# EAGLE design EBN_WPWR_V01 (EAGLE 7.3.0)
CNAME: EasyBoard Nano; CREVISION: 2.0; DESIGNER: Martin Olejar
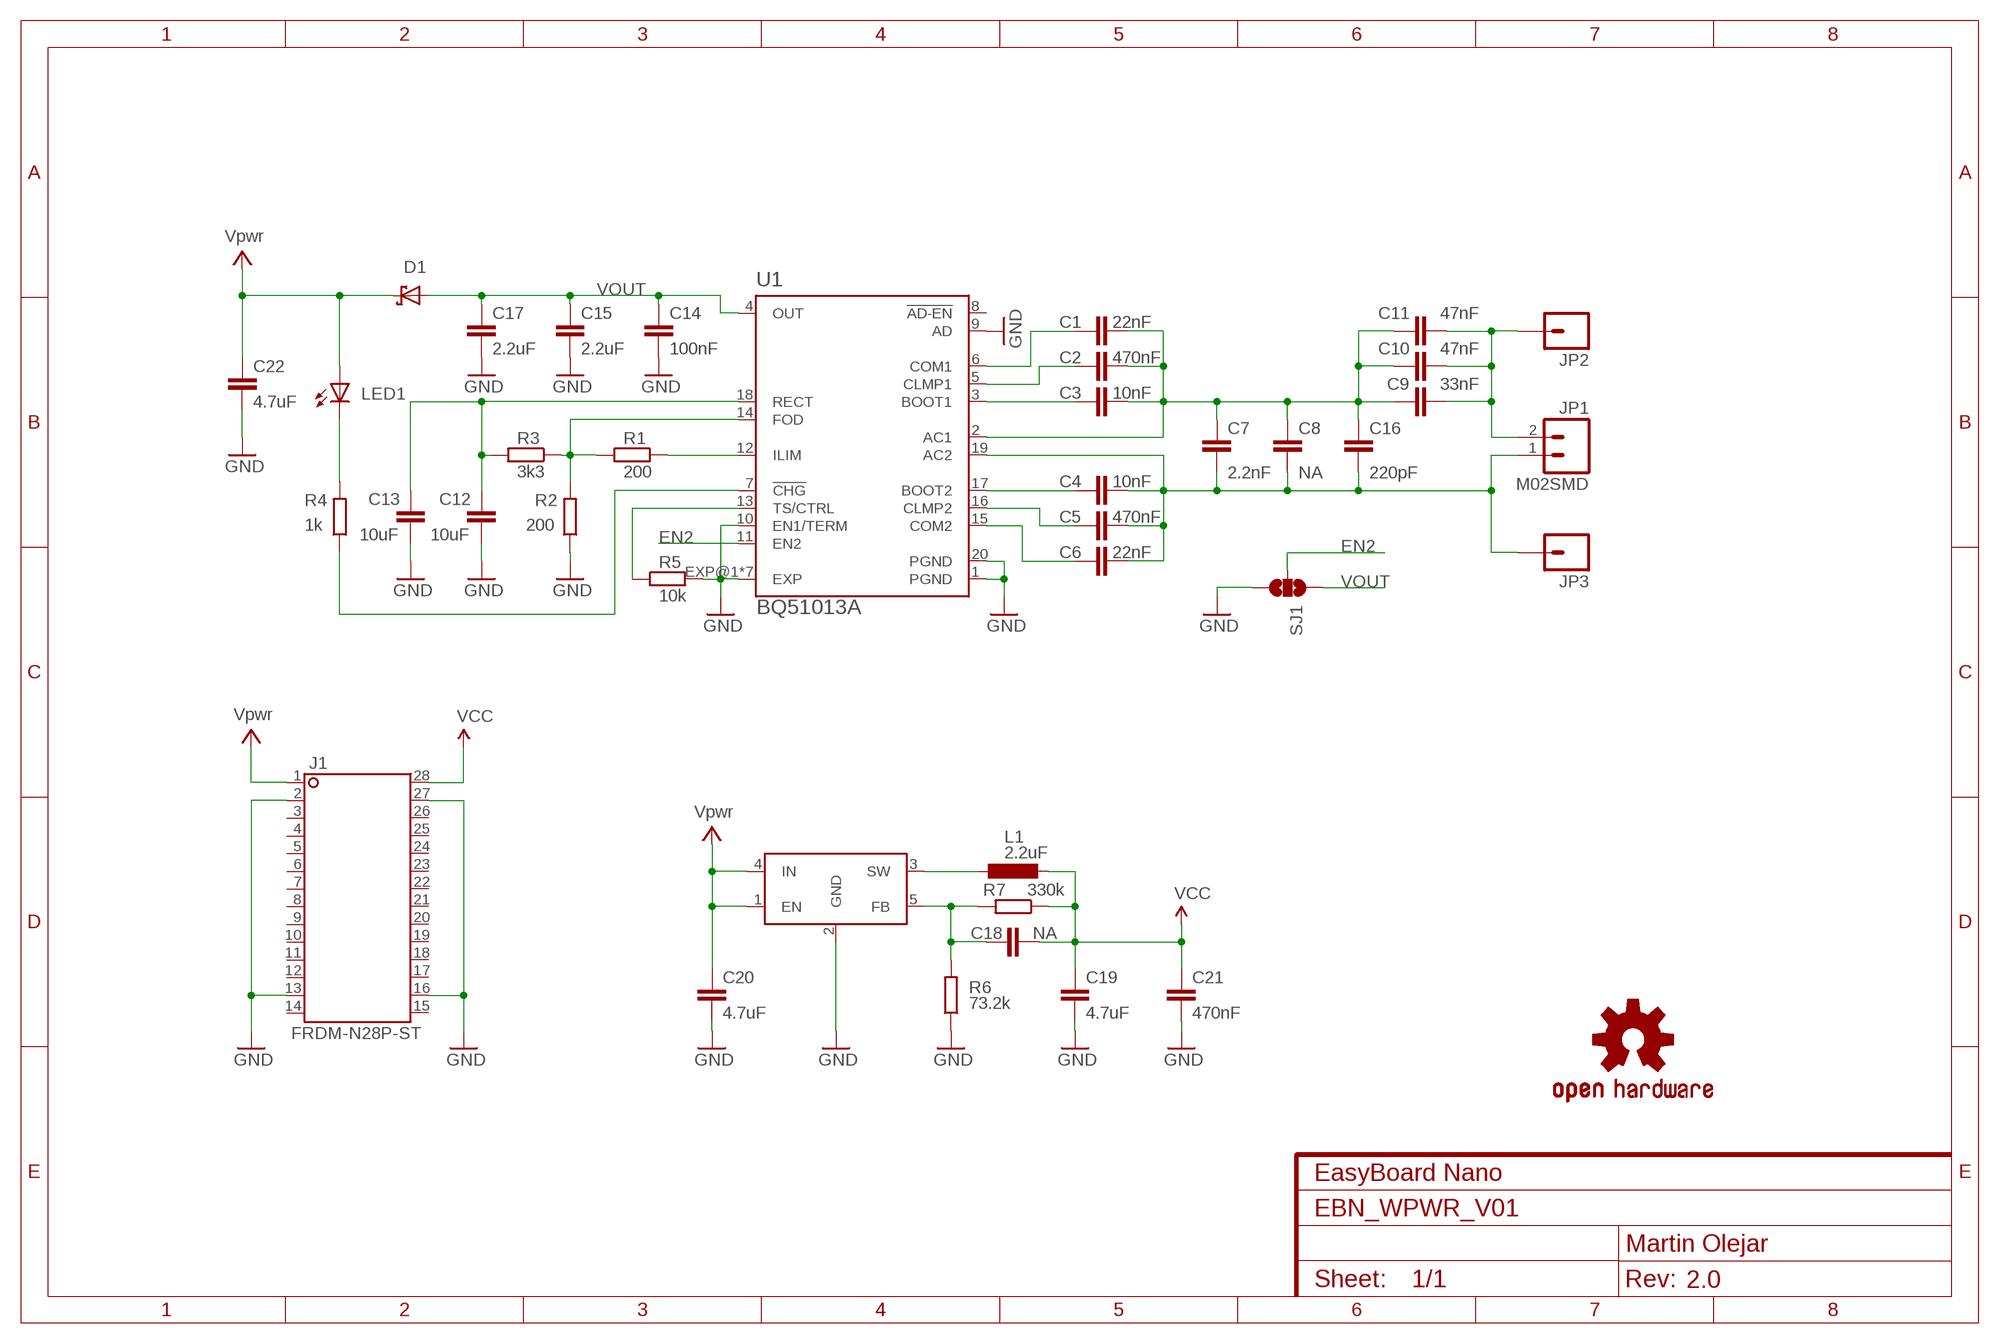
[diagram p0: schematic, sheet 1]

## Parts
C1  22nF  C-EUC0603  [C0603]
C2  470nF  C-EUC0603  [C0603]
C3  10nF  C-EUC0603  [C0603]
C4  10nF  C-EUC0603  [C0603]
C5  470nF  C-EUC0603  [C0603]
C6  22nF  C-EUC0603  [C0603]
C7  2.2nF  C-EUC0603  [C0603]
C8  NA  C-EUC0603  [C0603]
C9  33nF  C-EUC0603  [C0603]
C10  47nF  C-EUC0603  [C0603]
C11  47nF  C-EUC0603  [C0603]
C12  10uF  C-EUC0805  [C0805]
C13  10uF  C-EUC0805  [C0805]
C14  100nF  C-EUC0603  [C0603]
C15  2.2uF  C-EUC0603  [C0603]
C16  220pF  C-EUC0603  [C0603]
C17  2.2uF  C-EUC0603  [C0603]
C18  NA  C-EUC0603  [C0603]
C19  4.7uF  C-EUC0603  [C0603]
C20  4.7uF  C-EUC0603  [C0603]
C21  470nF  C-EUC0603  [C0603]
C22  4.7uF  C-EUC0603  [C0603]
D1  PMEG2010BER-SHOTTKY-SOD123FL  [SOD-123FL]
J1  FRDM-N28P-ST  [FRDM-N28P-SHIELD]
JP1  M02SMD  [1X02-1.25MM_SMD]
JP2  M01PTH_LONGPAD  [1X01_LONGPAD]
JP3  M01PTH_LONGPAD  [1X01_LONGPAD]
L1  2.2uF  L-EULPS3015  [LPS3015]
LED1  LEDCHIPLED_0603  [CHIPLED_0603]
LOGO1  OSHW-LOGOS  [OSHW-LOGO-S]
R1  200  R-EUR0603  [R0603]
R2  200  R-EUR0603  [R0603]
R3  3k3  R-EUR0603  [R0603]
R4  1k  R-EUR0603  [R0603]
R5  10k  R-EUR0603  [R0603]
R6  73.2k  R-EUR0603  [R0603]
R7  330k  R-EUR0603  [R0603]
SJ1  SJ2W-S  [JUMPER-SMD-S2X]
U1  BQ51013A  [RHL_R-VQFN-N20]
U$1  MP215P  [SOT23-5L]

## Nets
EN2: SJ1.2 U1.11(EN2)
GND: C12.1 C13.1 C14.1 C15.1 C17.1 C19.1 C20.1 C21.1 C22.1 J1.2 J1.13 J1.16 J1.27 R2.1 R5.2 R6.1 SJ1.3 U1.1(PGND) U1.9(AD) U1.10(EN1/TERM) U1.20(PGND) U1.EXP@1(EXP) U1.EXP@2(EXP) U1.EXP@3(EXP) U1.EXP@4(EXP) U1.EXP@5(EXP) U1.EXP@6(EXP) U1.EXP@7(EXP) U$1.2(GND)
N$1: C3.1 U1.3(BOOT1)
N$2: C2.1 U1.5(CLMP1)
N$3: C1.1 U1.6(COM1)
N$4: C1.2 C2.2 C3.2 C7.2 C8.2 C9.2 C10.2 C11.2 C16.2 U1.2(AC1)
N$5: C4.2 C5.2 C6.2 C7.1 C8.1 C16.1 JP1.1 JP3.1 U1.19(AC2)
N$6: C4.1 U1.17(BOOT2)
N$7: C5.1 U1.16(CLMP2)
N$8: C6.1 U1.15(COM2)
N$9: C9.1 C10.1 C11.1 JP1.2 JP2.1
N$11: LED1.C R4.2
N$12: R4.1 U1.7(!CHG)
N$14: R1.2 U1.12(ILIM)
N$15: R1.1 R2.2 R3.1 U1.14(FOD)
N$16: C12.2 C13.2 R3.2 U1.18(RECT)
N$24: L1.P$1 U$1.3(SW)
N$25: C18.2 R6.2 R7.2 U$1.5(FB)
PWR: C20.2 C22.2 D1.C J1.1 LED1.A U$1.1(EN) U$1.4(IN) ; supply symbol labelled Vpwr
TS: R5.1 U1.13(TS/CTRL)
VCC: C18.1 C19.2 C21.2 J1.28 L1.P$2 R7.1
VOUT: C14.2 C15.2 C17.2 D1.A SJ1.1 U1.4(OUT)
Unconnected: J1.3 J1.4 J1.5 J1.6 J1.7 J1.8 J1.9 J1.10 J1.11 J1.12 J1.14 J1.15 J1.17 J1.18 J1.19 J1.20 J1.21 J1.22 J1.23 J1.24 J1.25 J1.26 U1.8(!AD-EN)

## Library data of the parts
C1-C22 = atomx_RLC:C-EU: CAPACITOR, European symbol
D1 = atomx_DiscreteSemi:*-SHOTTKY-
J1 = atomx_Boards:FRDM-N28P: Dual In Line
JP1 = atomx_Connectors:M02: Standard 2-pin 0.1" header. Use with - straight break away headers ( PRT-00116) - right angle break away headers (PRT-00553) - swiss pins (PRT-00743) - machine pins (PRT-00117) - female headers (PRT-00115) Molex polarized connector foot print use with: PRT-08233 with associated crimp pins and housings. 2.54_SCREWTERM for use with PRT-10571. 3.5mm Screw Terminal footprints for PRT-08084 5mm Screw Terminal footprints for use with PRT-08432
JP2 JP3 = atomx_Connectors:M01: Header 1 Standard 1-pin 0.1" header. Use with straight break away headers (SKU : PRT-00116), right angle break away headers (PRT-00553), swiss pins (PRT-00743), machine pins (PRT-00117), and female headers (PRT-00115).
L1 = atomx_RLC:L-EU: INDUCTOR, European symbol
LED1 = atomx_Optic:LED: LED OSRAM: - CHIPLED LG R971, LG N971, LY N971, LG Q971, LY Q971, LO R971, LY R971 LH N974, LH R974 LS Q976, LO Q976, LY Q976 LO Q996 - Hyper CHIPLED LW Q18S LB Q993, LB Q99A, LB R99A - SideLED LS A670, LO A670, LY A670, LG A670, LP A670 LB A673, LV A673, LT A673, LW A673 LH A674 LY A675 LS A676, LA A676, LO A676, LY A676, LW A676 LS A679, LY A679, LG A679 - Hyper Micro SIDELED® LS Y876, LA Y876, LO Y876, LY Y876 LT Y87S - SmartLED LW L88C, LW L88S LB L89C, LB L89S, LG L890 LS L89K, LO L89K, LY L89K LS L896, LA L896, LO L896, LY L896 - TOPLED LS T670, LO T670, LY T670, LG T670, LP T670 LSG T670, LSP T670, LSY T670, LOP T670, LYG T670 LG T671, LOG T671, LSG T671 LB T673, LV T673, LT T673, LW T673 LH T674 LS T676, LA T676, LO T676, LY T676, LB T676, LH T676, LSB T676, LW T676 LB T67C, LV T67C, LT T67C, LS T67K, LO T67K, LY T67K, LW E67C LS E67B, LA E67B, LO E67B, LY E67B, LB E67C, LV E67C, LT E67C LW T67C LS T679, LY T679, LG T679 LS T770, LO T770, LY T770, LG T770, LP T770 LB T773, LV T773, LT T773, LW T773 LH T774 LS E675, LA E675, LY E675, LS T675 LS T776, LA T776, LO T776, LY T776, LB T776 LHGB T686 LT T68C, LB T68C - Hyper Mini TOPLED® LB M676 - Mini TOPLED Santana® LG M470 LS M47K, LO M47K, LY M47K Source: http://www.osram.convergy.de LUXEON: - LUMILED® LXK2-PW12-R00, LXK2-PW12-S00, LXK2-PW14-U00, LXK2-PW14-V00 LXK2-PM12-R00, LXK2-PM12-S00, LXK2-PM14-U00 LXK2-PE12-Q00, LXK2-PE12-R00, LXK2-PE12-S00, LXK2-PE14-T00, LXK2-PE14-U00 LXK2-PB12-K00, LXK2-PB12-L00, LXK2-PB12-M00, LXK2-PB14-N00, LXK2-PB14-P00, LXK2-PB14-Q00 LXK2-PR12-L00, LXK2-PR12-M00, LXK2-PR14-Q00, LXK2-PR14-R00 LXK2-PD12-Q00, LXK2-PD12-R00, LXK2-PD12-S00 LXK2-PH12-R00, LXK2-PH12-S00 LXK2-PL12-P00, LXK2-PL12-Q00, LXK2-PL12-R00 Source: www.luxeon.com KINGBRIGHT: KA-3528ASYC Source: www.kingbright.com
LOGO1 = atomx_Common:OSHW-LOGO: Open Source Hardware Logo This logo indicates the piece of hardware it is found on incorporates a OSHW license and/or adheres to the definition of open source hardware found here: http://freedomdefined.org/OSHW
R1-R7 = atomx_RLC:R-EU: RESISTOR, European symbol
SJ1 = atomx_Connectors:SJ2W: SMD solder JUMPER
U1 = atomx_Power:BQ51013A: Integrated Wireless Power Supply Receiver, Qi Compliant
U$1 = atomx_Power:MP21*5P

## Board
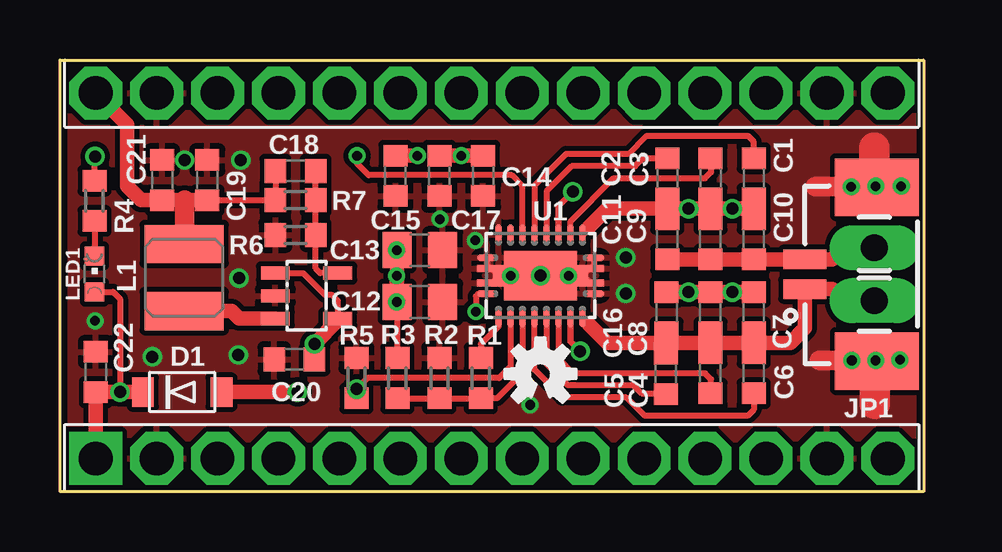
[diagram p1: board, top side]
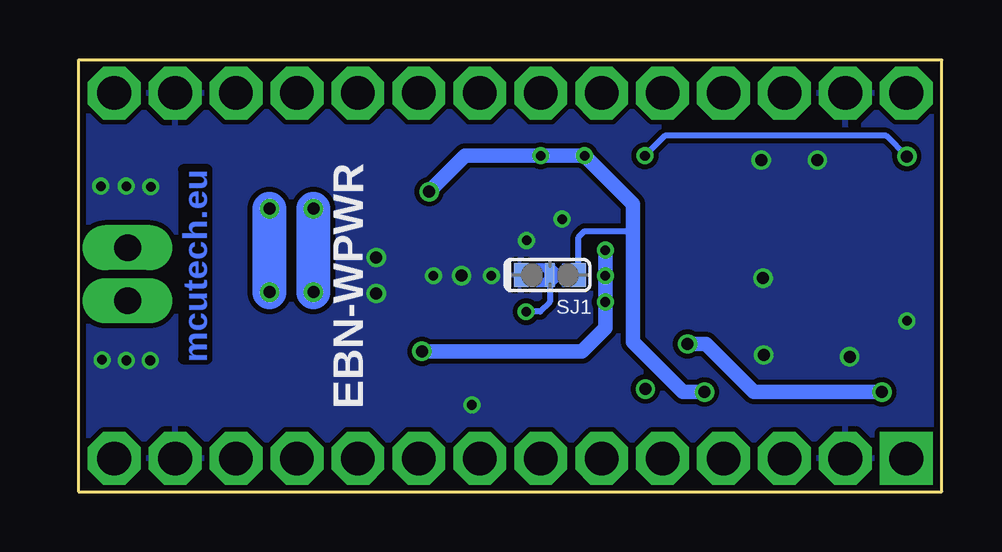
[diagram p2: board, bottom side, seen from below]

Size 36 x 18 mm. Coordinates in mm from the lower left corner, seen from the top.
Copper layers (1*16): Top 0.035mm / dielectric 1.5mm / Bottom 0.035mm
Design rules "ITEADstudio_DRC *": minimum track width 6mil, minimum drill 12mil, track to track 8mil, track to pad 8mil, pad to pad 8mil, via to via 8mil, smd to smd 0mil, copper to edge 10mil, drill to drill 10mil, minimum pad ring 10mil, minimum via ring 6mil, stop-mask expansion 2mil, vias tented up to drill 100mil, thermal gap 10mil

### Footprints (pad centres in the part's own frame; a part is rotated, then mirrored left to right if it is on the bottom)
C0603 = smd 0.9 x 1: 1 -0.84,0; 2 0.84,0
C0805 = smd 1.2 x 1.5: 1 -0.95,0; 2 0.95,0
SOD-123FL = smd 0.91 x 1.22: A 1.637,0; C -1.637,0
FRDM-N28P-SHIELD = drill 1.4 pad 2.2 square: 1 -16.51,-7.62 | drill 1.4 pad 2.2 octagon: 2 -13.97,-7.62; 3 -11.43,-7.62; 4 -8.89,-7.62; 5 -6.35,-7.62; 6 -3.81,-7.62; 7 -1.27,-7.62; 8 1.27,-7.62; 9 3.81,-7.62; 10 6.35,-7.62; 11 8.89,-7.62; 12 11.43,-7.62; 13 13.97,-7.62; 14 16.51,-7.62; 15 16.51,7.62; 16 13.97,7.62; 17 11.43,7.62; 18 8.89,7.62; 19 6.35,7.62; 20 3.81,7.62; 21 1.27,7.62; 22 -1.27,7.62; 23 -3.81,7.62; 24 -6.35,7.62; 25 -8.89,7.62; 26 -11.43,7.62; 27 -13.97,7.62; 28 -16.51,7.62
1X02-1.25MM_SMD = smd 0.8 x 1.8: 1 0,0; 2 1.25,0 | smd 2.4 x 3.5: P$5 -3,-3; P$6 4.25,-3
1X01_LONGPAD = drill 1.118 pad 1.88 long: 1 0,0
LPS3015 = smd 1.6 x 3.3: P$1 -1.4,0; P$2 1.4,0
CHIPLED_0603 = smd 0.8 x 0.8: A 0,-0.75; C 0,0.75
R0603 = smd 0.9 x 1: 1 -0.84,0; 2 0.84,0
JUMPER-SMD-S2X = smd 0.6 x 1: 1 -1.2,0; 3 1.2,0 | smd 0.4 x 1: 2 0,0
RHL_R-VQFN-N20 = smd 0.85 x 0.28: 1 -2.225,-0.75; 10 2.225,-0.75; 11 2.225,0.75; 20 -2.225,0.75 | smd 0.28 x 0.85: 2 -1.75,-1.725; 3 -1.25,-1.725; 4 -0.75,-1.725; 5 -0.25,-1.725; 6 0.25,-1.725; 7 0.75,-1.725; 8 1.25,-1.725; 9 1.75,-1.725; 12 1.75,1.725; 13 1.25,1.725; 14 0.75,1.725; 15 0.25,1.725; 16 -0.25,1.725; 17 -0.75,1.725; 18 -1.25,1.725; 19 -1.75,1.725 | smd 3.05 x 2.05: EXP@1 0,0 | smd 1.125 x 0.28: EXP@2 2.075,-0.3; EXP@4 2.075,0.3; EXP@5 -2.075,0.3; EXP@7 -2.075,-0.3 | smd 0.45 x 0.4: EXP@3 1.75,0; EXP@6 -1.75,0
SOT23-5L = smd 0.55 x 1.2: 1 -0.95,-1.3; 2 0,-1.3; 3 0.95,-1.3; 4 0.95,1.3; 5 -0.95,1.3

### Placement (x,y rotation side)
C1  28.92,13.06 270 top
C2  25.32,13.06 270 top
C3  27.12,13.06 270 top
C4  27.12,4.94 90 top
C5  25.26,4.91 90 top
C6  28.92,4.94 90 top
C7  28.92,7.48 90 top
C8  27.12,7.48 90 top
C9  27.12,10.52 90 top
C10  28.92,10.52 90 top
C11  25.32,10.52 90 top
C12  15,7.91 180 top
C13  15,10.07 180 top
C14  17.64,13.17 90 top
C15  13.99,13.17 90 top
C16  25.29,7.48 90 top
C17  15.82,13.17 90 top
C18  9.82,13.37 0 top
C19  6.14,12.99 270 top
C20  9.77,5.52 0 top
C21  4.26,12.99 270 top
C22  1.49,4.99 270 top
D1  5.1,4.15 0 top
J1  18,9 0 top
JP1  31.06,8.44 90 top
JP2  33.95,10.17 270 top
JP3  33.95,7.96 90 top
L1  5.17,8.92 90 top
LED1  1.44,9.08 0 top
LOGO1  20.03,4.91 0 top
R1  17.54,4.73 90 top
R2  15.82,4.73 270 top
R3  14.06,4.73 90 top
R4  1.44,12.12 270 top
R5  12.36,4.73 90 top
R6  9.82,10.7 0 top
R7  9.82,12.15 0 top
SJ1  16.35,9.03 180 bottom
U1  20.03,9 180 top
U$1  10.28,8.16 270 top

### Tracks (layer width: path | path; a pad name or v marks a point on that pad's centre or on a via)
EN2  (via drill 0.4)
  Top 0.254: U1.11 17.45,8.25 17.34,8.14 v17.34,7.5
  Bottom 0.254: SJ1.2 16.35,7.91 16.76,7.5 v17.34,7.5
GND  (via drill 0.4, 0.5)
  Top 0.254: U1.1 22.26,9.45 U1.EXP@7 22.08,9.3 U1.EXP@6 21.81,9 U1.EXP@5 | U1.10 17.81,9.45 U1.EXP@2 17.98,9.3 U1.EXP@3 | U1.EXP@4 17.98,8.7 U1.EXP@3 | U1.EXP@3 v18.79,9
  Top 0.813: 31.49,12.71 33.42,12.71 | 31.66,5.47 33.06,5.47
  Top 1.27: 33.95,12.15 33.95,14.33 | 33.98,3.67 33.98,5.44
  other vias: 20.03,9 21.2,9 23.59,8.26 23.59,9.76 15.84,11.36 17.31,10.47 1.46,7.12 7.43,5.7 7.46,8.9 5.2,13.83 7.54,13.83 32.99,12.71 35.07,12.73 34,12.73 34,5.47 19.6,3.62 33.01,5.47 35.02,5.49 3.85,5.62
  pour Bottom: -0.01,17.99 36.01,17.99 36.01,0.03 -0.01,0.03
  pour Top: -0.01,17.99 36.01,17.99 36.01,0.03 -0.01,0.03
N$1
  Top 0.254: C3.1 27.14,13.32 26.89,13.06 23.08,13.06 21.28,11.27 U1.3
N$2
  Top 0.254: C2.1 25.36,13.9 24.3,13.9 23.97,13.57 21.33,13.57 20.29,12.53 U1.5
N$3
  Top 0.254: C1.1 28.92,14.59 28.67,14.84 24.45,14.84 23.69,14.08 21.1,14.08 19.78,12.76 U1.6
N$4  (via drill 0.5)
  Top 0.254: v28.03,8.31 28.41,8.31 28.41,8.32
  Top 0.305: U1.2 22.04,11 | 25.44,11.79 C11.2
  Top 0.61: 22.04,11 22.83,11.79 25.44,11.79 v26.2,11.79 27.14,11.79 | C16.2 C8.2 28.41,8.32 C7.2 | 27.14,11.79 v28.03,11.79 28.67,11.79 | 28.67,11.79 28.92,11.54 | C1.2 28.92,12.05 | 28.92,11.54 C10.2 | C3.2 27.14,11.79 | 28.67,11.79 28.92,12.05 | 28.92,12.05 28.92,11.54 | C9.2 27.14,11.79 | C2.2 C11.2
  Bottom 1.422: v26.2,8.31 v26.2,11.79 | v28.03,8.31 v28.03,11.79
N$5
  Top 0.305: U1.19 22.04,7 | 25.44,6.21 C5.2
  Top 0.61: 22.04,7 22.83,6.21 25.37,6.21 | 25.37,6.21 25.44,6.21 27.14,6.21 | 29.18,6.21 30.45,6.21 31.06,6.82 JP1.1 32.2,8.44 32.68,7.96 JP3.1 | 29.18,6.21 28.92,5.95 C6.2 | 29.18,6.21 27.14,6.21 | 25.37,6.21 C16.1 | 27.14,6.21 C4.2 | C7.1 29.18,6.38 29.18,6.21 | C8.1 27.14,6.21
N$6
  Top 0.254: C4.1 27.14,4.68 26.89,4.94 21.4,4.94 20.79,5.55 20.79,7.26 U1.17
N$7
  Top 0.254: U1.16 20.29,5.32 21.15,4.45 23.89,4.45 24.25,4.1 25.36,4.1 C5.1
N$8
  Top 0.254: C6.1 28.92,3.41 28.67,3.16 24.38,3.16 23.61,3.92 20.95,3.92 19.78,5.09 U1.15
N$9
  Top 0.61: C11.1 C9.1 C10.1 31.15,9.68 JP1.2 32.17,9.69 32.66,10.17 JP2.1
N$10
  cutout Top: 19.68,10.07 20.39,10.07 20.39,10.24 19.68,10.24
N$11
  Top 0.254: R4.2 LED1.C
N$12  (via drill 0.4, 0.5)
  Top 0.254: U1.7 19.28,12.75 18.84,13.19 12.87,13.19 12.39,13.67 v12.39,14 | R4.1 1.44,13.95 v1.46,13.98
  Bottom 0.254: v1.46,13.98 2.33,14.84 11.55,14.84 v12.39,14
N$14
  Top 0.254: U1.12 18.28,6.89 17.54,6.16 R1.2
N$15
  Top 0.254: U1.14 19.28,4.95 18.23,3.89 R1.1 R2.2 R3.1
N$16  (via drill 0.4, 0.5)
  Top 0.254: R3.2 14.06,7.88 v14.04,7.91
  Top 0.28: U1.18 21.28,6.25 v21.68,5.85
  Top 0.61: C13.2 14.05,9.02 v14.04,9 | v14.04,7.91 v14.04,9 | v14.04,9 14.04,9.03 | C12.2 14.05,8.98 v14.04,9
  Bottom 0.61: v14.04,10.07 v14.04,9 v14.04,7.91 14.04,6.82 15,5.85 v21.68,5.85
N$17
  cutout Top: 19.6,7.93 20.49,7.93 20.49,7.73 19.6,7.73
N$24
  Top 0.61: U$1.3 7.47,7.21 7.15,7.53 L1.P$1
N$25
  Top 0.254: U$1.5 10.85,9.11 10.66,9.3 R6.2 R7.2 C18.2
PWR  (via drill 0.5)
  Top 0.254: LED1.A 2.21,8.33 2.51,8.03 v2.51,4.15 | U$1.1 10.14,9.11 11.04,8.21 11.32,8.21 11.57,7.96 U$1.4
  Top 0.61: C22.2 | C22.2 J1.1 | C20.2 10.61,5.62 10.61,5.63 v10.61,6.16 11.58,7.13 U$1.4 | C22.2 v2.5,4.15 v2.51,4.15 D1.C
  Bottom 0.61: v2.51,4.15 7.84,4.15 9.85,6.16 v10.61,6.16
TS  (via drill 0.5)
  Top 0.254: U1.13 18.78,5.21 18.3,4.73 12.82,4.73 v12.36,4.28 R5.1
VCC
  Top 0.254: C18.1 R7.1 6.29,12.15 C19.2
  Top 0.61: 4.84,12.15 C21.2 | C21.2 5.2,12.15 C19.2 | J1.28 2.81,15.3 2.81,12.73 3.39,12.15 C21.2
  Top 0.813: L1.P$2 5.2,10.35 5.2,12.15
VOUT  (via drill 0.4, 0.5)
  Top 0.28: U1.4 20.78,11.91 v21.38,12.51
  Top 0.61: C15.2 v14.9,14.01 v14.9,14 | C17.2 v16.73,14.01 | v16.73,14.01 v16.73,14 | C14.2 v16.73,14.01 | D1.A v9.9,4.15
  Bottom 0.254: SJ1.1 15.15,10.61 14.9,10.85 12.95,10.85 12.89,10.91
  Bottom 0.61: v21.38,12.51 19.88,14 v16.73,14 v14.9,14 12.89,12 12.89,10.91 12.89,6.23 10.81,4.15 v9.9,4.15

### Text on the board
Bottom: mcutech.eu
bPlace: EBN-WPWR